# Altium schematic sheet top.SchDoc
size A4
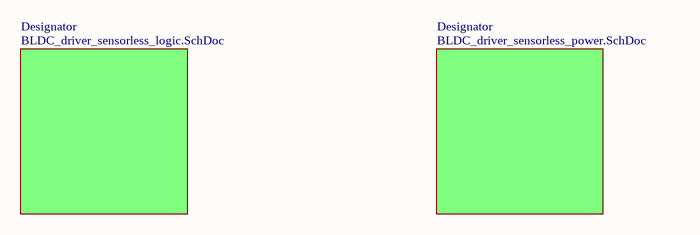
[diagram p0: top.SchDoc]

## Sub-sheets
Designator = BLDC_driver_sensorless_logic.SchDoc: no entries
Designator = BLDC_driver_sensorless_power.SchDoc: no entries

## Notes on the sheet
- Drawn by :
- Date :
- Project :
- Version :